# EAGLE schematic DetBackplane01 (EAGLE 7.7.0)
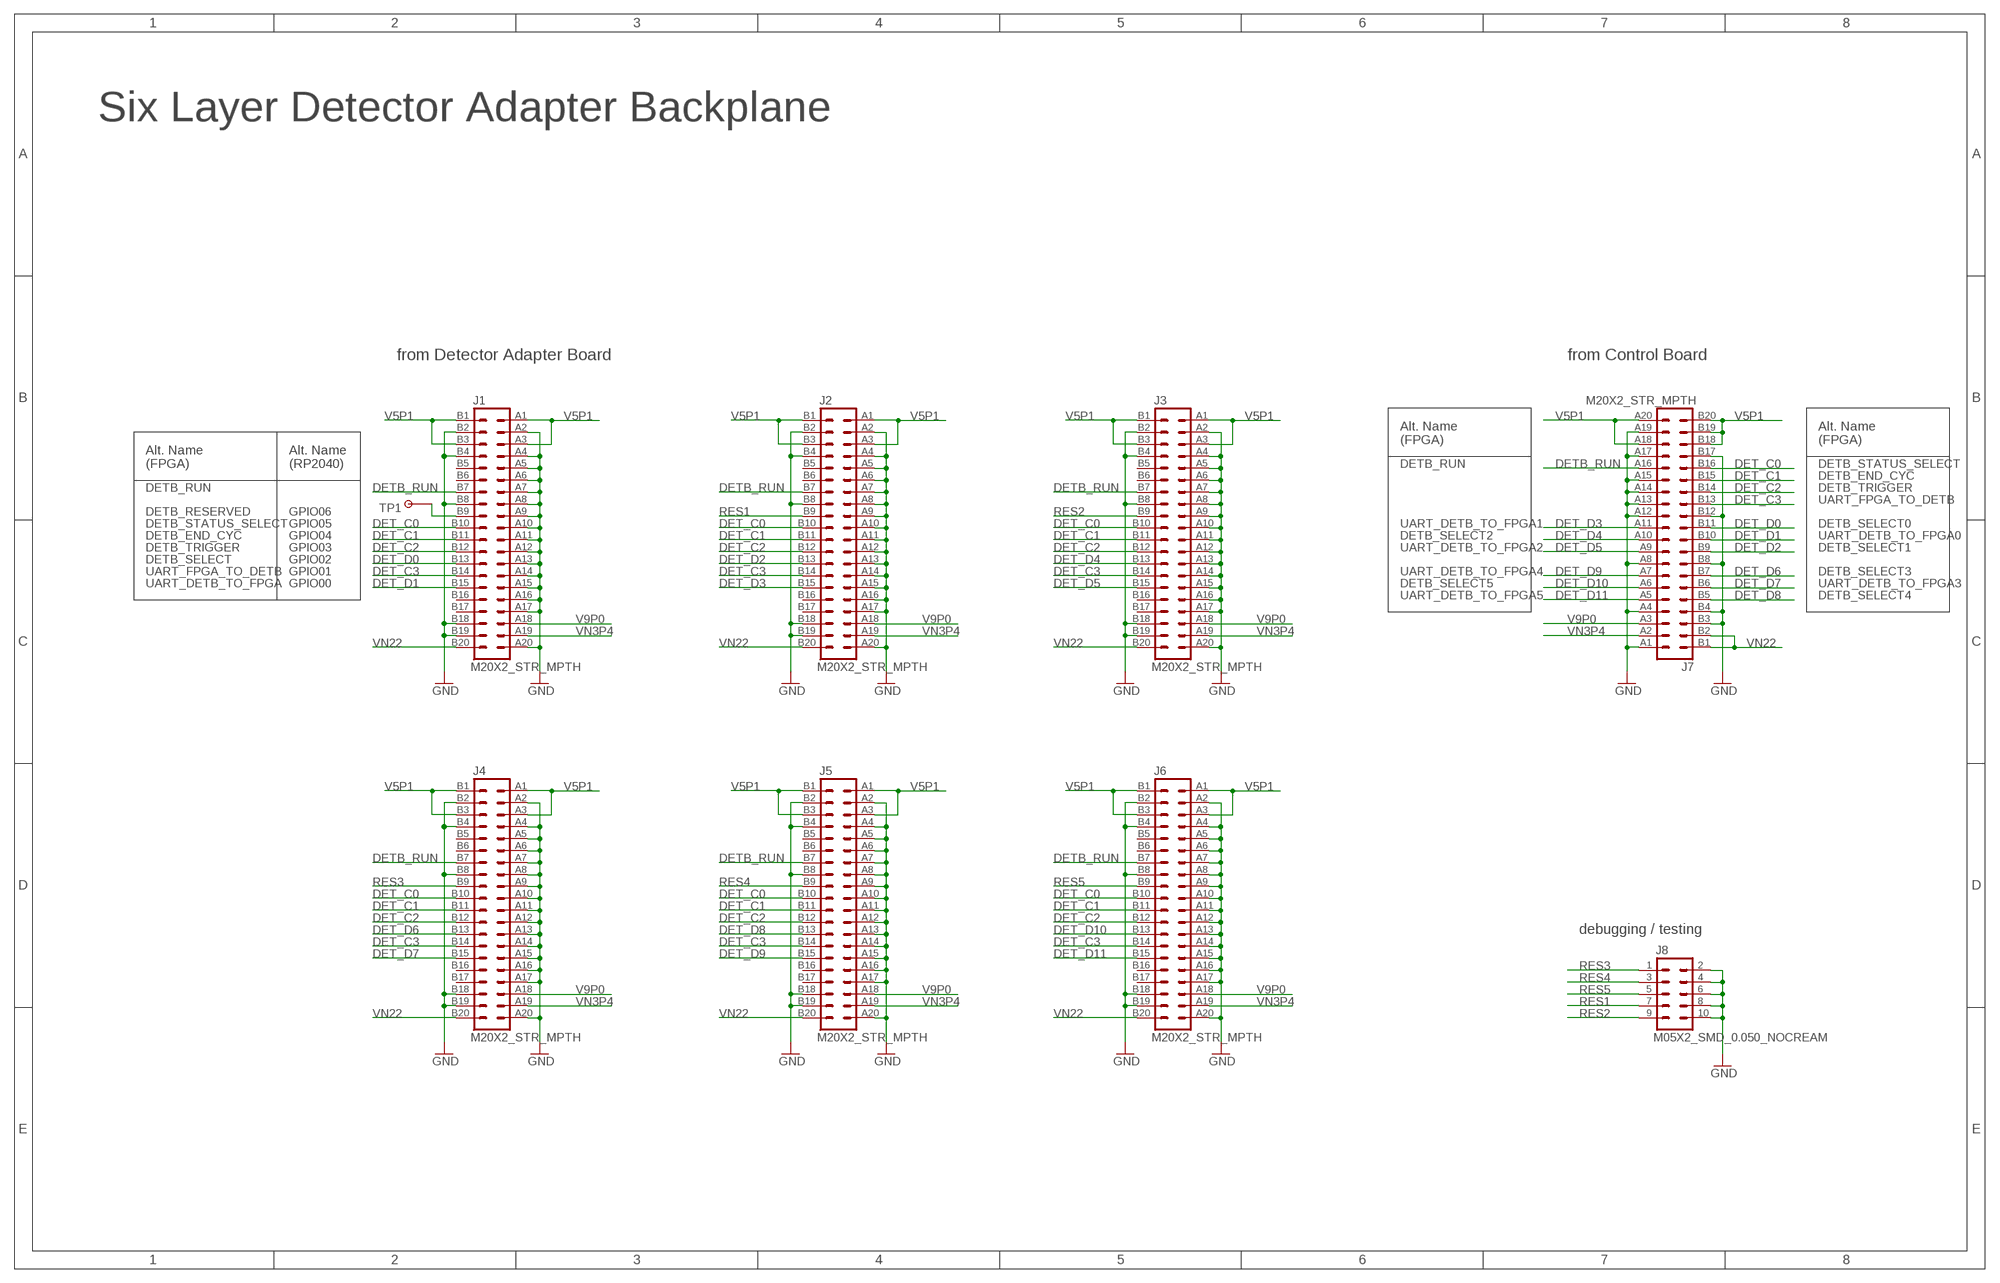
[diagram p0: schematic, sheet 1]

## Parts
J1  M20X2_STR_MPTH  [M20X2_HARFLEX_F_STR_MPTH]
J2  M20X2_STR_MPTH  [M20X2_HARFLEX_F_STR_MPTH]
J3  M20X2_STR_MPTH  [M20X2_HARFLEX_F_STR_MPTH]
J4  M20X2_STR_MPTH  [M20X2_HARFLEX_F_STR_MPTH]
J5  M20X2_STR_MPTH  [M20X2_HARFLEX_F_STR_MPTH]
J6  M20X2_STR_MPTH  [M20X2_HARFLEX_F_STR_MPTH]
J7  M20X2_STR_MPTH  [M20X2_HARFLEX_F_STR_MPTH]
J8  M05X2_SMD_0.050_NOCREAM  [M05X2_0.050_SMD_NO_CREAM]
TP1  TESTPOINT_ROUND  [TESTPAD_ROUND]

## Nets
DET_C0: J1.B10 J2.B10 J3.B10 J4.B10 J5.B10 J6.B10 J7.B16
DET_C1: J1.B11 J2.B11 J3.B11 J4.B11 J5.B11 J6.B11 J7.B15
DET_C2: J1.B12 J2.B12 J3.B12 J4.B12 J5.B12 J6.B12 J7.B14
DET_C3: J1.B14 J2.B14 J3.B14 J4.B14 J5.B14 J6.B14 J7.B13
DET_D0: J1.B13 J7.B11
DET_D1: J1.B15 J7.B10
DET_D2: J2.B13 J7.B9
DET_D3: J2.B15 J7.A11
DET_D4: J3.B13 J7.A10
DET_D5: J3.B15 J7.A9
DET_D6: J4.B13 J7.B7
DET_D7: J4.B15 J7.B6
DET_D8: J5.B13 J7.B5
DET_D9: J5.B15 J7.A7
DET_D10: J6.B13 J7.A6
DET_D11: J6.B15 J7.A5
DETB_RUN: J1.B7 J2.B7 J3.B7 J4.B7 J5.B7 J6.B7 J7.A16
GND: J1.A2 J1.A4 J1.A5 J1.A6 J1.A7 J1.A8 J1.A9 J1.A10 J1.A11 J1.A12 J1.A13 J1.A14 J1.A15 J1.A16 J1.A17 J1.A20 J1.B2 J1.B4 J1.B8 J1.B18 J1.B19 J2.A2 J2.A4 J2.A5 J2.A6 J2.A7 J2.A8 J2.A9 J2.A10 J2.A11 J2.A12 J2.A13 J2.A14 J2.A15 J2.A16 J2.A17 J2.A20 J2.B2 J2.B4 J2.B8 J2.B18 J2.B19 J3.A2 J3.A4 J3.A5 J3.A6 J3.A7 J3.A8 J3.A9 J3.A10 J3.A11 J3.A12 J3.A13 J3.A14 J3.A15 J3.A16 J3.A17 J3.A20 J3.B2 J3.B4 J3.B8 J3.B18 J3.B19 J4.A2 J4.A4 J4.A5 J4.A6 J4.A7 J4.A8 J4.A9 J4.A10 J4.A11 J4.A12 J4.A13 J4.A14 J4.A15 J4.A16 J4.A17 J4.A20 J4.B2 J4.B4 J4.B8 J4.B18 J4.B19 J5.A2 J5.A4 J5.A5 J5.A6 J5.A7 J5.A8 J5.A9 J5.A10 J5.A11 J5.A12 J5.A13 J5.A14 J5.A15 J5.A16 J5.A17 J5.A20 J5.B2 J5.B4 J5.B8 J5.B18 J5.B19 J6.A2 J6.A4 J6.A5 J6.A6 J6.A7 J6.A8 J6.A9 J6.A10 J6.A11 J6.A12 J6.A13 J6.A14 J6.A15 J6.A16 J6.A17 J6.A20 J6.B2 J6.B4 J6.B8 J6.B18 J6.B19 J7.A1 J7.A4 J7.A8 J7.A12 J7.A13 J7.A14 J7.A15 J7.A17 J7.A19 J7.B3 J7.B4 J7.B8 J7.B12 J7.B17 J8.2 J8.4 J8.6 J8.8 J8.10
N$1: J1.B9 TP1.P$1
RES1: J2.B9 J8.7
RES2: J3.B9 J8.9
RES3: J4.B9 J8.1
RES4: J5.B9 J8.3
RES5: J6.B9 J8.5
V5P1: J1.A1 J1.A3 J1.B1 J1.B3 J2.A1 J2.A3 J2.B1 J2.B3 J3.A1 J3.A3 J3.B1 J3.B3 J4.A1 J4.A3 J4.B1 J4.B3 J5.A1 J5.A3 J5.B1 J5.B3 J6.A1 J6.A3 J6.B1 J6.B3 J7.A18 J7.A20 J7.B18 J7.B19 J7.B20
V9P0: J1.A18 J2.A18 J3.A18 J4.A18 J5.A18 J6.A18 J7.A3
VN3P4: J1.A19 J2.A19 J3.A19 J4.A19 J5.A19 J6.A19 J7.A2
VN22: J1.B20 J2.B20 J3.B20 J4.B20 J5.B20 J6.B20 J7.B1 J7.B2
Unconnected: J1.B5 J1.B6 J1.B16 J1.B17 J2.B5 J2.B6 J2.B16 J2.B17 J3.B5 J3.B6 J3.B16 J3.B17 J4.B5 J4.B6 J4.B16 J4.B17 J5.B5 J5.B6 J5.B16 J5.B17 J6.B5 J6.B6 J6.B16 J6.B17

## Notes on the sheet
- Six Layer Detector Adapter Backplane
- from Detector Adapter Board | from Control Board
- Alt. Name
  (FPGA)
- Alt. Name
  (FPGA)
- Alt. Name
  (FPGA)
- Alt. Name
  (RP2040)
- DETB_RUN | DETB_STATUS_SELECT
- DETB_END_CYC
- DETB_RUN | DETB_TRIGGER
- UART_FPGA_TO_DETB
- DETB_RESERVED | GPIO06
- DETB_STATUS_SELECT | GPIO05 | UART_DETB_TO_FPGA1 | DETB_SELECT0
- DETB_END_CYC | GPIO04 | DETB_SELECT2 | UART_DETB_TO_FPGA0
- DETB_TRIGGER | GPIO03 | UART_DETB_TO_FPGA2 | DETB_SELECT1
- DETB_SELECT | GPIO02
- UART_FPGA_TO_DETB | GPIO01 | UART_DETB_TO_FPGA4 | DETB_SELECT3
- UART_DETB_TO_FPGA | GPIO00 | DETB_SELECT5 | UART_DETB_TO_FPGA3
- UART_DETB_TO_FPGA5 | DETB_SELECT4
- debugging / testing

## Library data of the parts
J1-J7 = MyLib:M20X2
J8 = MyLib:M05X2: Header M05X2 SMD_0.050: Sullind GRPB052VWQS-RC DigiKey S9012E-05-ND
TP1 = MyLib:TESTPOINT